# Altium schematic sheet SwitchMatrix.SchDoc
size A4
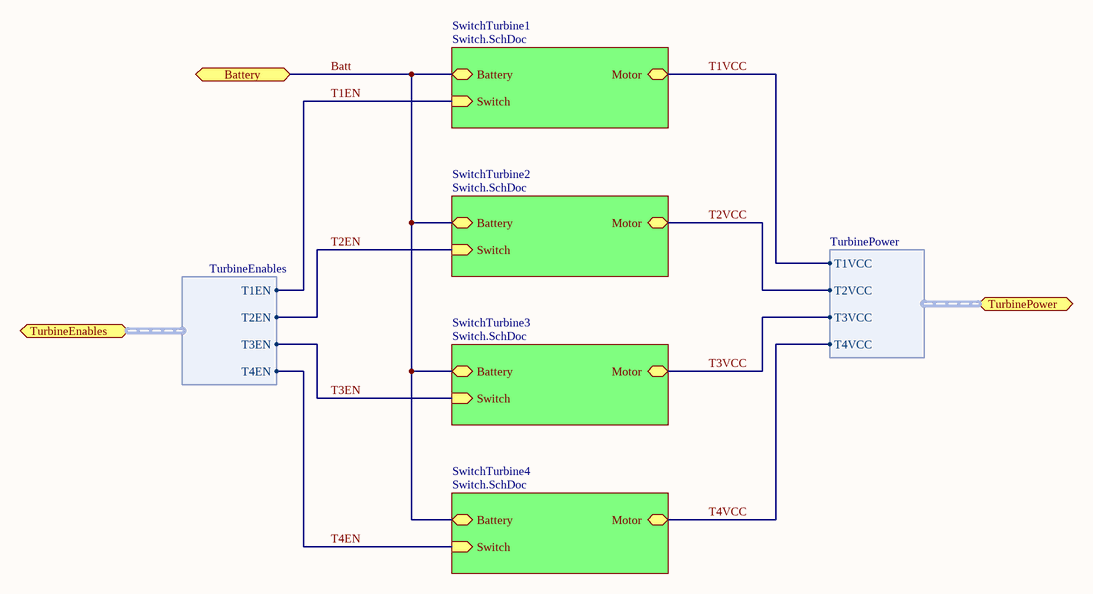
[diagram p0: SwitchMatrix.SchDoc]

## Sub-sheets
SwitchTurbine1 = Switch.SchDoc: Battery, Motor, Switch (in)
SwitchTurbine2 = Switch.SchDoc: Battery, Motor, Switch (in)
SwitchTurbine3 = Switch.SchDoc: Battery, Motor, Switch (in)
SwitchTurbine4 = Switch.SchDoc: Battery, Motor, Switch (in)

## Ports
Battery, TurbineEnables (harness TurbineEnables), TurbinePower (harness TurbinePower)

## Harnesses
TurbinePower: T1VCC, T2VCC, T3VCC, T4VCC
TurbineEnables: T1EN, T2EN, T3EN, T4EN

## Nets
Batt: port Battery, sheet SwitchTurbine1/Battery, sheet SwitchTurbine2/Battery, sheet SwitchTurbine3/Battery, sheet SwitchTurbine4/Battery
T1EN: sheet SwitchTurbine1/Switch, port TurbineEnables.T1EN
T1VCC: sheet SwitchTurbine1/Motor, port TurbinePower.T1VCC
T2EN: sheet SwitchTurbine2/Switch, port TurbineEnables.T2EN
T2VCC: sheet SwitchTurbine2/Motor, port TurbinePower.T2VCC
T3EN: sheet SwitchTurbine3/Switch, port TurbineEnables.T3EN
T3VCC: sheet SwitchTurbine3/Motor, port TurbinePower.T3VCC
T4EN: sheet SwitchTurbine4/Switch, port TurbineEnables.T4EN
T4VCC: sheet SwitchTurbine4/Motor, port TurbinePower.T4VCC